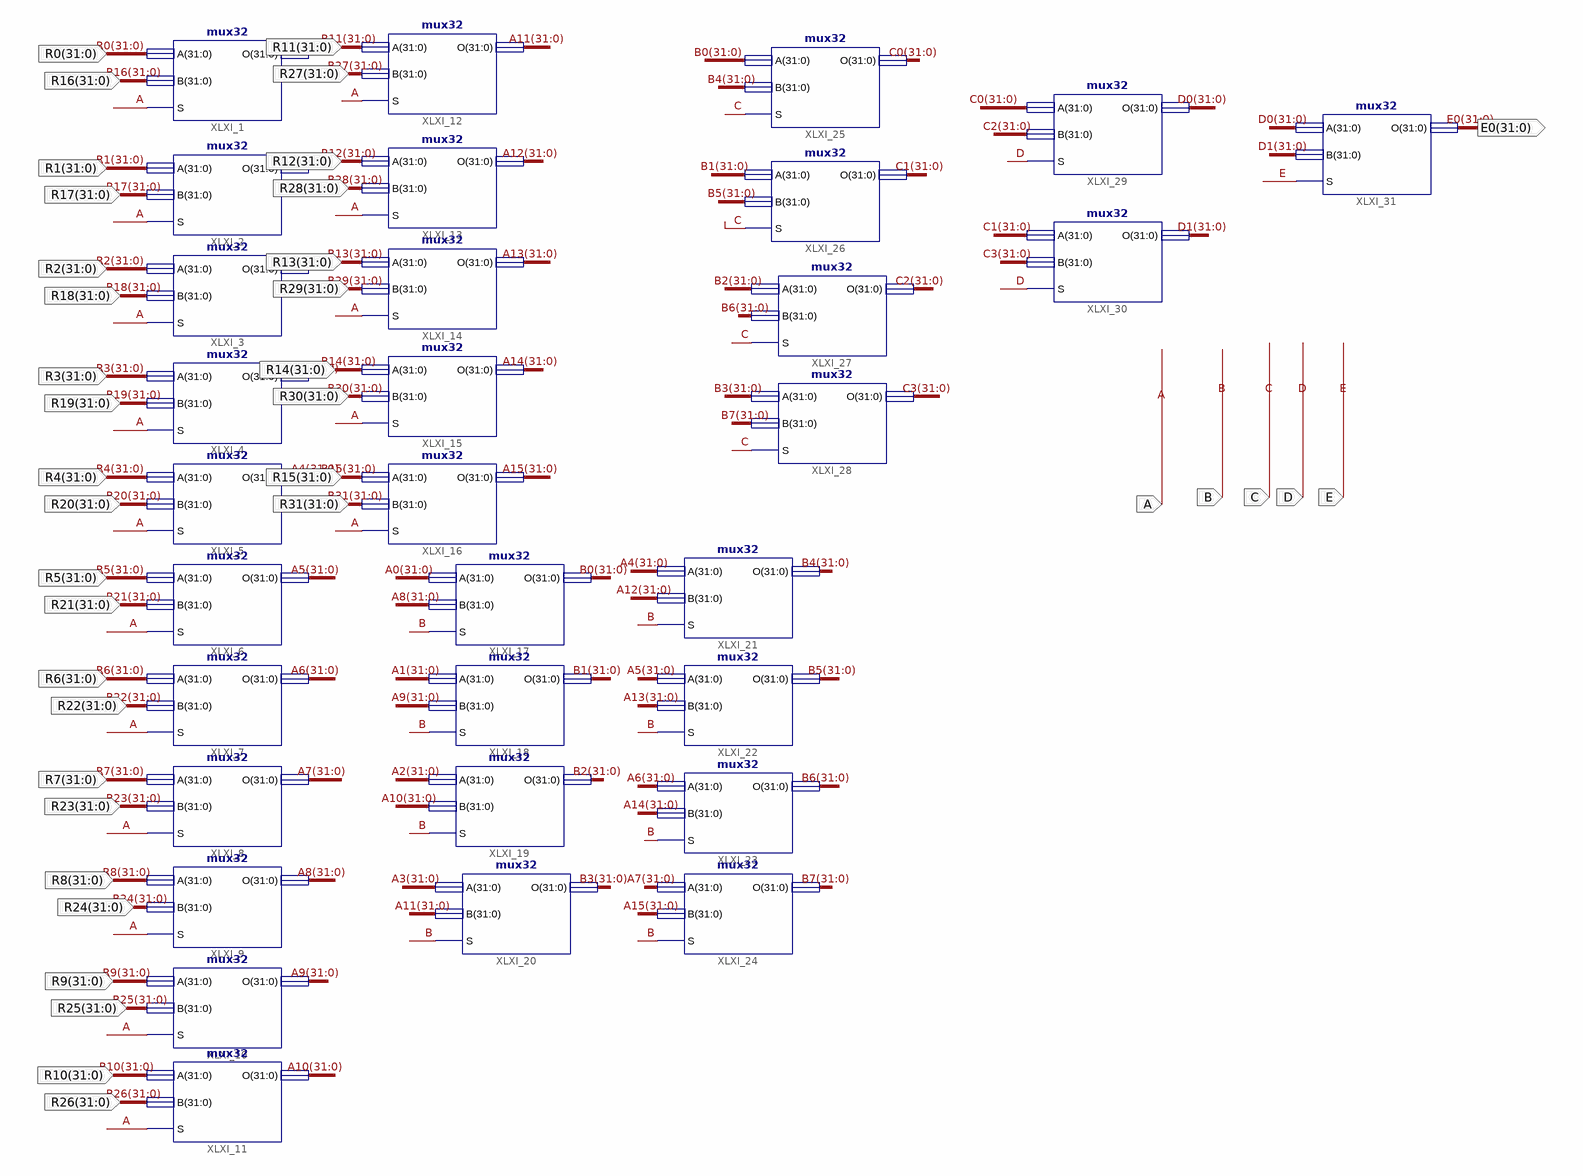
[diagram p0: schematic sheet 1]
// Xilinx ISE schematic mux32_32bits.sch (artix7) as structural Verilog: 31 symbols, 38 ports
module mux32_32bits (
  input  [31:0] R0,
  input  [31:0] R1,
  input  [31:0] R2,
  input  [31:0] R3,
  input  [31:0] R4,
  input  [31:0] R5,
  input  [31:0] R6,
  input  [31:0] R7,
  input  [31:0] R8,
  input  [31:0] R9,
  input  [31:0] R10,
  input  [31:0] R11,
  input  [31:0] R12,
  input  [31:0] R13,
  input  [31:0] R14,
  input  [31:0] R15,
  input  [31:0] R16,
  input  [31:0] R17,
  input  [31:0] R18,
  input  [31:0] R19,
  input  [31:0] R20,
  input  [31:0] R21,
  input  [31:0] R22,
  input  [31:0] R23,
  input  [31:0] R24,
  input  [31:0] R25,
  input  [31:0] R31,
  input  [31:0] R30,
  input  [31:0] R28,
  input  [31:0] R27,
  input  [31:0] R26,
  input  [31:0] R29,
  input  A,
  input  B,
  input  C,
  input  D,
  input  E,
  output [31:0] E0
);

  wire [31:0] A0, A1, A2, A3, A4, A5, A6, A7, A8, A9, A10, A11, A12, A13, A14, A15, B0, B1, B2, B3, B4, B5,
       B6, B7, C0, C1, C2, C3, D0, D1;

  mux32 XLXI_1 (.A(R0), .B(R16), .S(A), .O(A0));
  mux32 XLXI_2 (.A(R1), .B(R17), .S(A), .O(A1));
  mux32 XLXI_3 (.A(R2), .B(R18), .S(A), .O(A2));
  mux32 XLXI_4 (.A(R3), .B(R19), .S(A), .O(A3));
  mux32 XLXI_5 (.A(R4), .B(R20), .S(A), .O(A4));
  mux32 XLXI_6 (.A(R5), .B(R21), .S(A), .O(A5));
  mux32 XLXI_7 (.A(R6), .B(R22), .S(A), .O(A6));
  mux32 XLXI_8 (.A(R7), .B(R23), .S(A), .O(A7));
  mux32 XLXI_9 (.A(R8), .B(R24), .S(A), .O(A8));
  mux32 XLXI_10 (.A(R9), .B(R25), .S(A), .O(A9));
  mux32 XLXI_11 (.A(R10), .B(R26), .S(A), .O(A10));
  mux32 XLXI_12 (.A(R11), .B(R27), .S(A), .O(A11));
  mux32 XLXI_13 (.A(R12), .B(R28), .S(A), .O(A12));
  mux32 XLXI_14 (.A(R13), .B(R29), .S(A), .O(A13));
  mux32 XLXI_15 (.A(R14), .B(R30), .S(A), .O(A14));
  mux32 XLXI_16 (.A(R15), .B(R31), .S(A), .O(A15));
  mux32 XLXI_17 (.A(A0), .B(A8), .S(B), .O(B0));
  mux32 XLXI_18 (.A(A1), .B(A9), .S(B), .O(B1));
  mux32 XLXI_19 (.A(A2), .B(A10), .S(B), .O(B2));
  mux32 XLXI_20 (.A(A3), .B(A11), .S(B), .O(B3));
  mux32 XLXI_21 (.A(A4), .B(A12), .S(B), .O(B4));
  mux32 XLXI_22 (.A(A5), .B(A13), .S(B), .O(B5));
  mux32 XLXI_23 (.A(A6), .B(A14), .S(B), .O(B6));
  mux32 XLXI_24 (.A(A7), .B(A15), .S(B), .O(B7));
  mux32 XLXI_25 (.A(B0), .B(B4), .S(C), .O(C0));
  mux32 XLXI_26 (.A(B1), .B(B5), .S(C), .O(C1));
  mux32 XLXI_27 (.A(B2), .B(B6), .S(C), .O(C2));
  mux32 XLXI_28 (.A(B3), .B(B7), .S(C), .O(C3));
  mux32 XLXI_29 (.A(C0), .B(C2), .S(D), .O(D0));
  mux32 XLXI_30 (.A(C1), .B(C3), .S(D), .O(D1));
  mux32 XLXI_31 (.A(D0), .B(D1), .S(E), .O(E0));
endmodule
